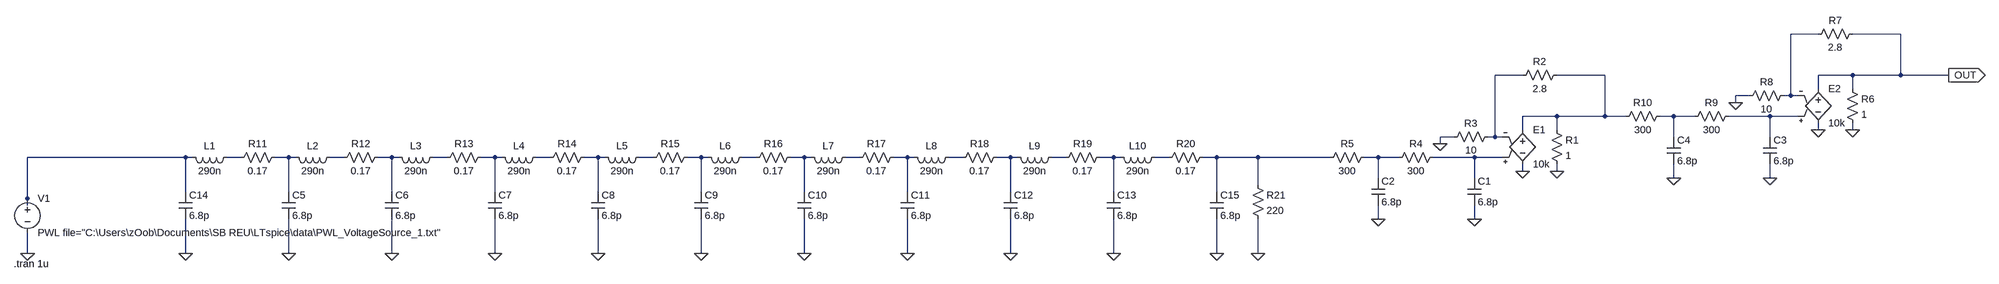
[diagram p0: schematic filter_test.asc]
filter_test.asc, the LTspice schematic file:
Version 4
SHEET 1 924 680
WIRE 512 -96 448 -96
WIRE 704 -96 592 -96
WIRE -176 0 -240 0
WIRE 16 0 -96 0
WIRE 592 0 512 0
WIRE 704 0 704 -96
WIRE 704 0 592 0
WIRE 816 0 704 0
WIRE 512 32 512 0
WIRE 592 32 592 0
WIRE 352 48 320 48
WIRE 448 48 448 -96
WIRE 448 48 432 48
WIRE 464 48 448 48
WIRE 320 64 320 48
WIRE -96 96 -176 96
WIRE 16 96 16 0
WIRE 16 96 -96 96
WIRE 64 96 16 96
WIRE 176 96 144 96
WIRE 224 96 176 96
WIRE 400 96 304 96
WIRE 464 96 400 96
WIRE -176 128 -176 96
WIRE -96 128 -96 96
WIRE 512 128 512 112
WIRE 592 128 592 112
WIRE -336 144 -368 144
WIRE -240 144 -240 0
WIRE -240 144 -256 144
WIRE -224 144 -240 144
WIRE 176 144 176 96
WIRE 400 144 400 96
WIRE -368 160 -368 144
WIRE -3296 192 -3664 192
WIRE -3280 192 -3296 192
WIRE -3168 192 -3200 192
WIRE -3056 192 -3088 192
WIRE -3040 192 -3056 192
WIRE -2928 192 -2960 192
WIRE -2816 192 -2848 192
WIRE -2800 192 -2816 192
WIRE -2688 192 -2720 192
WIRE -2576 192 -2608 192
WIRE -2560 192 -2576 192
WIRE -2448 192 -2480 192
WIRE -2336 192 -2368 192
WIRE -2320 192 -2336 192
WIRE -2208 192 -2240 192
WIRE -2096 192 -2128 192
WIRE -2080 192 -2096 192
WIRE -1968 192 -2000 192
WIRE -1856 192 -1888 192
WIRE -1840 192 -1856 192
WIRE -1728 192 -1760 192
WIRE -1616 192 -1648 192
WIRE -1600 192 -1616 192
WIRE -1488 192 -1520 192
WIRE -1376 192 -1408 192
WIRE -1360 192 -1376 192
WIRE -1248 192 -1280 192
WIRE -1136 192 -1168 192
WIRE -1120 192 -1136 192
WIRE -1008 192 -1040 192
WIRE -896 192 -928 192
WIRE -800 192 -896 192
WIRE -624 192 -800 192
WIRE -512 192 -544 192
WIRE -464 192 -512 192
WIRE -288 192 -384 192
WIRE -224 192 -288 192
WIRE -176 224 -176 208
WIRE -96 224 -96 208
WIRE -512 240 -512 192
WIRE -288 240 -288 192
WIRE 176 240 176 208
WIRE 400 240 400 208
WIRE -800 256 -800 192
WIRE -3296 272 -3296 192
WIRE -3056 272 -3056 192
WIRE -2816 272 -2816 192
WIRE -2576 272 -2576 192
WIRE -2336 272 -2336 192
WIRE -2096 272 -2096 192
WIRE -1856 272 -1856 192
WIRE -1616 272 -1616 192
WIRE -1376 272 -1376 192
WIRE -1136 272 -1136 192
WIRE -896 272 -896 192
WIRE -3664 288 -3664 192
WIRE -3664 304 -3664 288
WIRE -512 336 -512 304
WIRE -288 336 -288 304
WIRE -3664 416 -3664 368
WIRE -3296 416 -3296 336
WIRE -3056 416 -3056 336
WIRE -2816 416 -2816 336
WIRE -2576 416 -2576 336
WIRE -2336 416 -2336 336
WIRE -2096 416 -2096 336
WIRE -1856 416 -1856 336
WIRE -1616 416 -1616 336
WIRE -1376 416 -1376 336
WIRE -1136 416 -1136 336
WIRE -896 416 -896 336
WIRE -800 416 -800 336
FLAG -176 224 0
FLAG -96 224 0
FLAG -368 160 0
FLAG -288 336 0
FLAG 512 128 0
FLAG 592 128 0
FLAG 816 0 OUT
IOPIN 816 0 Out
FLAG 320 64 0
FLAG 400 240 0
FLAG 176 240 0
FLAG -3664 416 0
FLAG -3296 416 0
FLAG -3056 416 0
FLAG -2816 416 0
FLAG -2576 416 0
FLAG -2336 416 0
FLAG -2096 416 0
FLAG -1856 416 0
FLAG -1616 416 0
FLAG -1376 416 0
FLAG -1136 416 0
FLAG -896 416 0
FLAG -800 416 0
FLAG -512 336 0
SYMBOL res -112 112 R0
SYMATTR InstName R1
SYMATTR Value 1
SYMBOL e2 -176 112 R0
SYMATTR InstName E1
SYMATTR Value 10k
SYMBOL res -80 -16 R90
WINDOW 0 0 56 VBottom 2
WINDOW 3 32 56 VTop 2
SYMATTR InstName R2
SYMATTR Value 2.8
SYMBOL res -240 128 R90
WINDOW 0 0 56 VBottom 2
WINDOW 3 32 56 VTop 2
SYMATTR InstName R3
SYMATTR Value 10
SYMBOL res -368 176 R90
WINDOW 0 0 56 VBottom 2
WINDOW 3 32 56 VTop 2
SYMATTR InstName R4
SYMATTR Value 300
SYMBOL cap -304 240 R0
SYMATTR InstName C1
SYMATTR Value 6.8p
SYMBOL cap -528 240 R0
SYMATTR InstName C2
SYMATTR Value 6.8p
SYMBOL res -528 176 R90
WINDOW 0 0 56 VBottom 2
WINDOW 3 32 56 VTop 2
SYMATTR InstName R5
SYMATTR Value 300
SYMBOL res 576 16 R0
SYMATTR InstName R6
SYMATTR Value 1
SYMBOL e2 512 16 R0
SYMATTR InstName E2
SYMATTR Value 10k
SYMBOL res 608 -112 R90
WINDOW 0 0 56 VBottom 2
WINDOW 3 32 56 VTop 2
SYMATTR InstName R7
SYMATTR Value 2.8
SYMBOL res 448 32 R90
WINDOW 0 0 56 VBottom 2
WINDOW 3 32 56 VTop 2
SYMATTR InstName R8
SYMATTR Value 10
SYMBOL res 320 80 R90
WINDOW 0 0 56 VBottom 2
WINDOW 3 32 56 VTop 2
SYMATTR InstName R9
SYMATTR Value 300
SYMBOL cap 384 144 R0
SYMATTR InstName C3
SYMATTR Value 6.8p
SYMBOL cap 160 144 R0
SYMATTR InstName C4
SYMATTR Value 6.8p
SYMBOL res 160 80 R90
WINDOW 0 0 56 VBottom 2
WINDOW 3 32 56 VTop 2
SYMATTR InstName R10
SYMATTR Value 300
SYMBOL voltage -3664 272 R0
WINDOW 123 0 0 Left 0
WINDOW 39 0 0 Left 0
SYMATTR InstName V1
SYMATTR Value PWL file="C:\Users\zOob\Documents\SB REU\LTspice\data\PWL_VoltageSource_1.txt"
SYMBOL ind -3184 176 R90
WINDOW 0 5 56 VBottom 2
WINDOW 3 32 56 VTop 2
SYMATTR InstName L1
SYMATTR Value 290n
SYMBOL res -3072 176 R90
WINDOW 0 0 56 VBottom 2
WINDOW 3 32 56 VTop 2
SYMATTR InstName R11
SYMATTR Value 0.17
SYMBOL cap -3072 272 R0
SYMATTR InstName C5
SYMATTR Value 6.8p
SYMBOL ind -2944 176 R90
WINDOW 0 5 56 VBottom 2
WINDOW 3 32 56 VTop 2
SYMATTR InstName L2
SYMATTR Value 290n
SYMBOL res -2832 176 R90
WINDOW 0 0 56 VBottom 2
WINDOW 3 32 56 VTop 2
SYMATTR InstName R12
SYMATTR Value 0.17
SYMBOL cap -2832 272 R0
SYMATTR InstName C6
SYMATTR Value 6.8p
SYMBOL ind -2704 176 R90
WINDOW 0 5 56 VBottom 2
WINDOW 3 32 56 VTop 2
SYMATTR InstName L3
SYMATTR Value 290n
SYMBOL res -2592 176 R90
WINDOW 0 0 56 VBottom 2
WINDOW 3 32 56 VTop 2
SYMATTR InstName R13
SYMATTR Value 0.17
SYMBOL cap -2592 272 R0
SYMATTR InstName C7
SYMATTR Value 6.8p
SYMBOL ind -2464 176 R90
WINDOW 0 5 56 VBottom 2
WINDOW 3 32 56 VTop 2
SYMATTR InstName L4
SYMATTR Value 290n
SYMBOL res -2352 176 R90
WINDOW 0 0 56 VBottom 2
WINDOW 3 32 56 VTop 2
SYMATTR InstName R14
SYMATTR Value 0.17
SYMBOL cap -2352 272 R0
SYMATTR InstName C8
SYMATTR Value 6.8p
SYMBOL ind -2224 176 R90
WINDOW 0 5 56 VBottom 2
WINDOW 3 32 56 VTop 2
SYMATTR InstName L5
SYMATTR Value 290n
SYMBOL res -2112 176 R90
WINDOW 0 0 56 VBottom 2
WINDOW 3 32 56 VTop 2
SYMATTR InstName R15
SYMATTR Value 0.17
SYMBOL cap -2112 272 R0
SYMATTR InstName C9
SYMATTR Value 6.8p
SYMBOL ind -1984 176 R90
WINDOW 0 5 56 VBottom 2
WINDOW 3 32 56 VTop 2
SYMATTR InstName L6
SYMATTR Value 290n
SYMBOL res -1872 176 R90
WINDOW 0 0 56 VBottom 2
WINDOW 3 32 56 VTop 2
SYMATTR InstName R16
SYMATTR Value 0.17
SYMBOL cap -1872 272 R0
SYMATTR InstName C10
SYMATTR Value 6.8p
SYMBOL ind -1744 176 R90
WINDOW 0 5 56 VBottom 2
WINDOW 3 32 56 VTop 2
SYMATTR InstName L7
SYMATTR Value 290n
SYMBOL res -1632 176 R90
WINDOW 0 0 56 VBottom 2
WINDOW 3 32 56 VTop 2
SYMATTR InstName R17
SYMATTR Value 0.17
SYMBOL cap -1632 272 R0
SYMATTR InstName C11
SYMATTR Value 6.8p
SYMBOL ind -1504 176 R90
WINDOW 0 5 56 VBottom 2
WINDOW 3 32 56 VTop 2
SYMATTR InstName L8
SYMATTR Value 290n
SYMBOL res -1392 176 R90
WINDOW 0 0 56 VBottom 2
WINDOW 3 32 56 VTop 2
SYMATTR InstName R18
SYMATTR Value 0.17
SYMBOL cap -1392 272 R0
SYMATTR InstName C12
SYMATTR Value 6.8p
SYMBOL ind -1264 176 R90
WINDOW 0 5 56 VBottom 2
WINDOW 3 32 56 VTop 2
SYMATTR InstName L9
SYMATTR Value 290n
SYMBOL res -1152 176 R90
WINDOW 0 0 56 VBottom 2
WINDOW 3 32 56 VTop 2
SYMATTR InstName R19
SYMATTR Value 0.17
SYMBOL cap -1152 272 R0
SYMATTR InstName C13
SYMATTR Value 6.8p
SYMBOL ind -1024 176 R90
WINDOW 0 5 56 VBottom 2
WINDOW 3 32 56 VTop 2
SYMATTR InstName L10
SYMATTR Value 290n
SYMBOL res -912 176 R90
WINDOW 0 0 56 VBottom 2
WINDOW 3 32 56 VTop 2
SYMATTR InstName R20
SYMATTR Value 0.17
SYMBOL cap -3312 272 R0
SYMATTR InstName C14
SYMATTR Value 6.8p
SYMBOL cap -912 272 R0
SYMATTR InstName C15
SYMATTR Value 6.8p
SYMBOL res -816 240 R0
SYMATTR InstName R21
SYMATTR Value 220
TEXT -3696 440 Left 2 !.tran 1u

The netlist it stands for:
* filter_test.asc
R1 N003 0 1
E1 N003 0 N028 N002 10k
R2 N003 N002 2.8
R3 N002 0 10
R4 N028 N027 300
C1 N028 0 6.8p
C2 N027 0 6.8p
R5 N027 N026 300
R6 OUT 0 1
E2 OUT 0 N005 N001 10k
R7 OUT N001 2.8
R8 N001 0 10
R9 N005 N004 300
C3 N005 0 6.8p
C4 N004 0 6.8p
R10 N004 N003 300
V1 N006 0 PWL file="C:\Users\zOob\Documents\SB REU\LTspice\data\PWL_VoltageSource_1.txt"
L1 N007 N006 290n
R11 N008 N007 0.17
C5 N008 0 6.8p
L2 N009 N008 290n
R12 N010 N009 0.17
C6 N010 0 6.8p
L3 N011 N010 290n
R13 N012 N011 0.17
C7 N012 0 6.8p
L4 N013 N012 290n
R14 N014 N013 0.17
C8 N014 0 6.8p
L5 N015 N014 290n
R15 N016 N015 0.17
C9 N016 0 6.8p
L6 N017 N016 290n
R16 N018 N017 0.17
C10 N018 0 6.8p
L7 N019 N018 290n
R17 N020 N019 0.17
C11 N020 0 6.8p
L8 N021 N020 290n
R18 N022 N021 0.17
C12 N022 0 6.8p
L9 N023 N022 290n
R19 N024 N023 0.17
C13 N024 0 6.8p
L10 N025 N024 290n
R20 N026 N025 0.17
C14 N006 0 6.8p
C15 N026 0 6.8p
R21 N026 0 220
.tran 1u
.backanno
.end